# EAGLE design esp-energy-monitor-v2 (EAGLE 9.6.2)
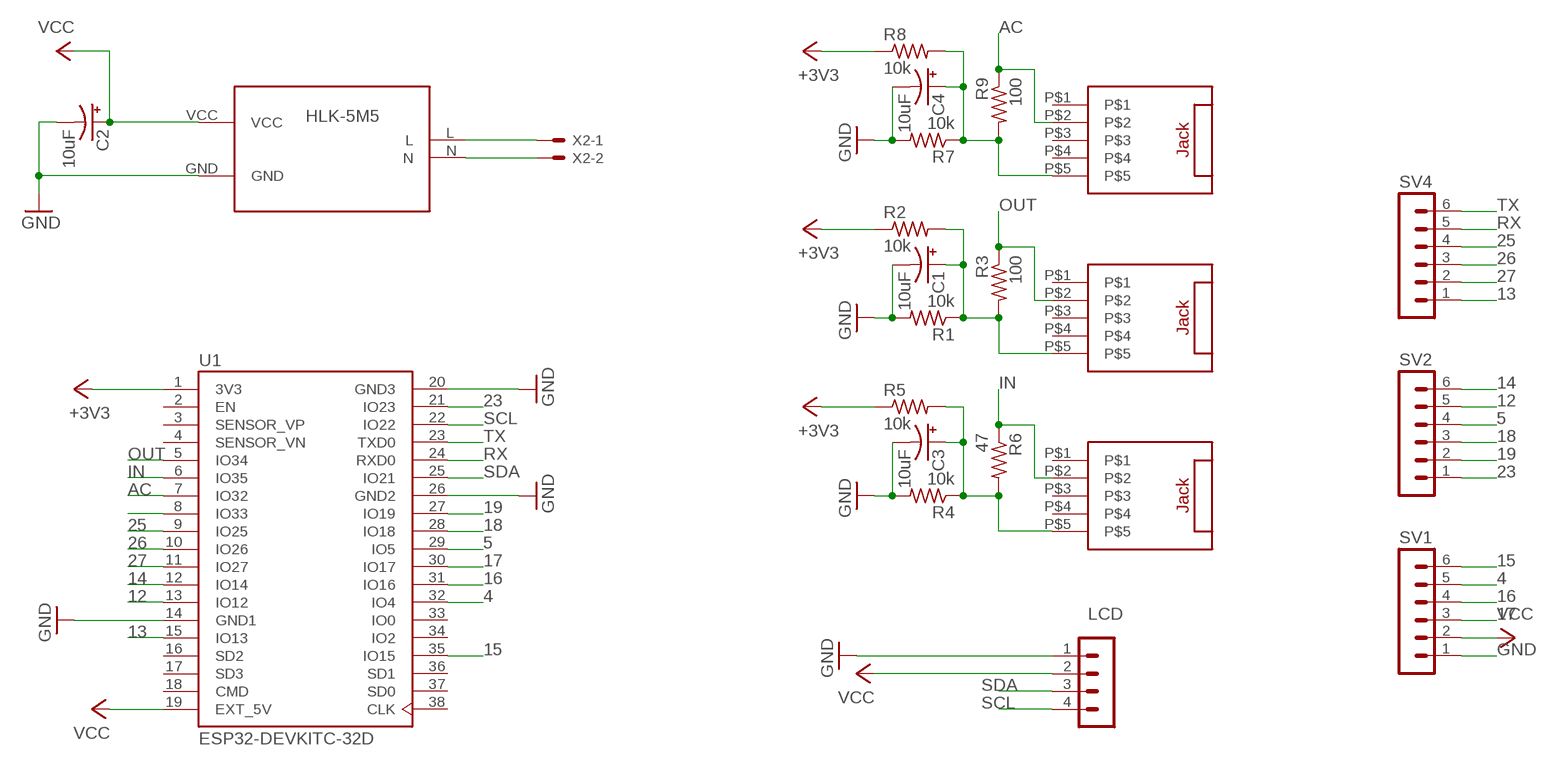
[diagram p0: schematic, sheet 1]

## Parts
ACJACK  JACK_5PINS  [JACK_5PINS]
C1  10uF  CPOL-USB45181A  [B45181A]
C2  10uF  CPOL-USB45181A  [B45181A]
C3  10uF  CPOL-USB45181A  [B45181A]
C4  10uF  CPOL-USB45181A  [B45181A]
HLK-5M5  HLK-5M05  [CONV_HLK-5M05]
INJACK  JACK_5PINS  [JACK_5PINS]
OUTJACK  JACK_5PINS  [JACK_5PINS]
R1  10k  R-US_0204/7  [0204/7]
R2  10k  R-US_0204/7  [0204/7]
R3  100  R-US_0204/7  [0204/7]
R4  10k  R-US_0204/7  [0204/7]
R5  10k  R-US_0204/7  [0204/7]
R6  47  R-US_0204/7  [0204/7]
R7  10k  R-US_0204/7  [0204/7]
R8  10k  R-US_0204/7  [0204/7]
R9  100  R-US_0204/7  [0204/7]
SV1  MA06-1  [MA06-1]
SV2  MA06-1  [MA06-1]
SV3  MA04-1  [MA04-1]
SV4  MA06-1  [MA06-1]
U1  ESP32-DEVKITC-32D  [MODULE_ESP32-DEVKITC-32D]
X2  JST-XH-02-PIN-LONG-PAD  [JST-XH-02-PACKAGE-LONG-PAD]

## Nets
4: SV1.5 U1.32(IO4)
5: SV2.4 U1.29(IO5)
12: SV2.5 U1.13(IO12)
13: SV4.1 U1.15(IO13)
14: SV2.6 U1.12(IO14)
15: SV1.6 U1.35(IO15)
16: SV1.4 U1.31(IO16)
17: SV1.3 U1.30(IO17)
18: SV2.3 U1.28(IO18)
19: SV2.2 U1.27(IO19)
23: SV2.1 U1.21(IO23)
25: SV4.4 U1.9(IO25)
26: SV4.3 U1.10(IO26)
27: SV4.2 U1.11(IO27)
+3V3: R2.1 R5.1 R8.1 U1.1(3V3)
AC: ACJACK.P$2 R9.1 U1.7(IO32)
GND: C1.- C2.- C3.- C4.- HLK-5M5.GND R1.2 R4.2 R7.2 SV1.1 SV3.1 U1.14(GND1) U1.20(GND3) U1.26(GND2)
IN: INJACK.P$2 R6.1 U1.6(IO35)
N$1: HLK-5M5.N X2.2
N$2: HLK-5M5.L X2.1
N$3: C1.+ OUTJACK.P$5 R1.1 R2.2 R3.2
N$4: ACJACK.P$5 C4.+ R7.1 R8.2 R9.2
N$5: C3.+ INJACK.P$5 R4.1 R5.2 R6.2
N$23: U1.8(IO33)
OUT: OUTJACK.P$2 R3.1 U1.5(IO34)
RX: SV4.5 U1.24(RXD0)
SCL: SV3.4 U1.22(IO22)
SDA: SV3.3 U1.25(IO21)
TX: SV4.6 U1.23(TXD0)
VCC: C2.+ HLK-5M5.VCC SV1.2 SV3.2 U1.19(EXT_5V)
Unconnected: ACJACK.P$1 ACJACK.P$3 ACJACK.P$4 INJACK.P$1 INJACK.P$3 INJACK.P$4 OUTJACK.P$1 OUTJACK.P$3 OUTJACK.P$4 U1.2(EN) U1.3(SENSOR_VP) U1.4(SENSOR_VN) U1.16(SD2) U1.17(SD3) U1.18(CMD) U1.33(IO0) U1.34(IO2) U1.36(SD1) U1.37(SD0) U1.38(CLK)

## Notes on the sheet
- HLK-5M5
- LCD

## Library data of the parts
ACJACK INJACK OUTJACK = jack:JACK_5PINS
C1-C4 = adafruit:CPOL-US: POLARIZED CAPACITOR, American symbol
HLK-5M5 = HLK-PM03:HLK-5M05
R1-R9 = adafruit:R-US_: RESISTOR, American symbol
SV1 SV2 SV4 = con-lstb:MA06-1: PIN HEADER; OC_FARNELL: unknown; OC_NEWARK: unknown
SV3 = con-lstb:MA04-1: PIN HEADER; OC_FARNELL: unknown; OC_NEWARK: unknown
U1 = ESP32-DEVKITC-32D:ESP32-DEVKITC-32D: Eval Board For Esp-Wroom-32 Check availability <https://pricing.snapeda.com/parts/ESP32-DEVKITC-32D/Espressif%20Systems/view-part?ref=eda>; AVAILABILITY: In Stock; DESCRIPTION: WiFi Development Tools (802.11) ESP32 General Development Kit, ESP32-WROOM-32D on the board; MF: Espressif Systems; MP: ESP32-DEVKITC-32D; PACKAGE: None; PRICE: None; PURCHASE-URL: https://pricing.snapeda.com/search/part/ESP32-DEVKITC-32D/?ref=eda
X2 = jstConnector-2.5:JST-XH-02-PIN: JST XH Connector 2 Pin Wire to board connector. Pitch: 2,54 mm, (0.100") Number of pins: 2 Created by Rembrandt Electronics www.rembrandtelectronics.com

## Net classes
0 default: width 0.406 mm

## Board
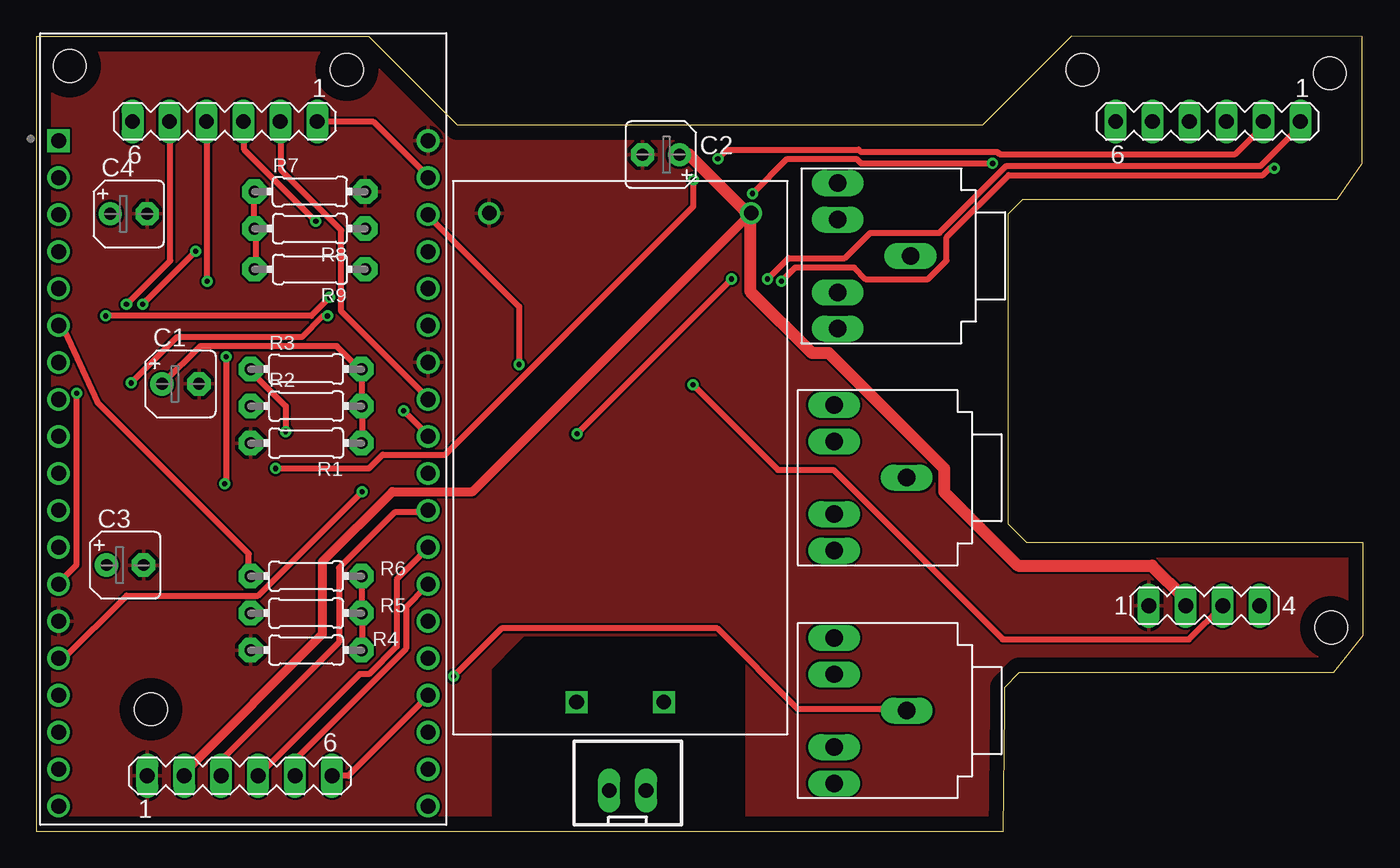
[diagram p1: board, top side]
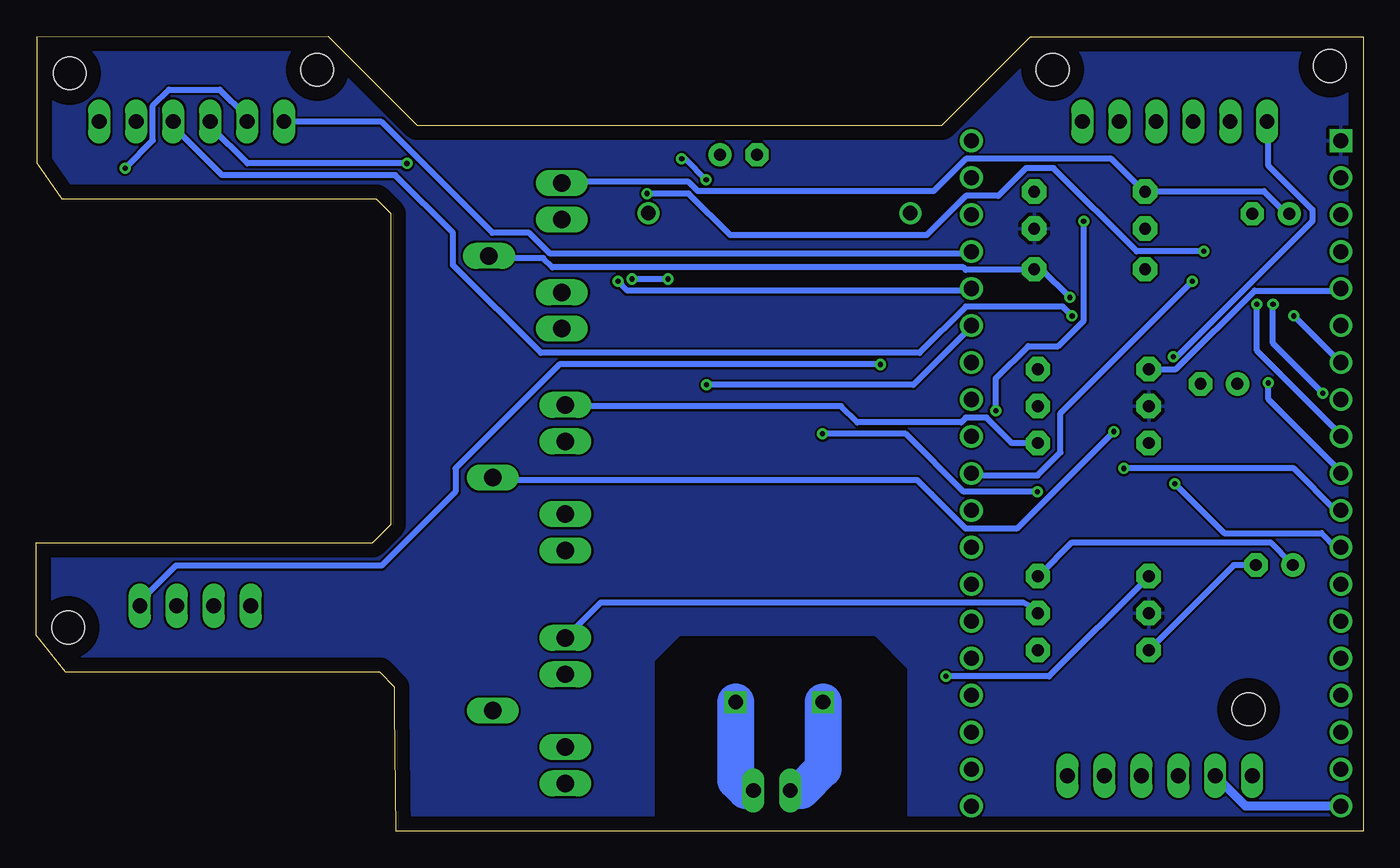
[diagram p2: board, bottom side, seen from below]

Size 91.19 x 54.61 mm. Coordinates in mm from the lower left corner, seen from the top.
Outline: 0,0 66.47,0 66.55,8.38 66.55,9.91 67.56,10.92 89.15,10.92 91.19,13.46 91.19,19.81 68.07,19.81 66.8,21.08 66.8,42.42 67.82,43.43 89.41,43.43 91.11,45.9 91.11,54.6 71.12,54.61 65.02,48.51 28.96,48.51 22.87,54.6 0,54.6 0,0
Copper layers (1*16): Top 0.035mm / dielectric 1.5mm / Bottom 0.035mm
Design rules "default": minimum track width 6mil, minimum drill 0.35mm, track to track 6mil, track to pad 6mil, pad to pad 6mil, via to via 6mil, smd to smd 6mil, copper to edge 40mil, drill to drill 6mil, minimum pad ring 10mil, minimum via ring 8mil, stop-mask expansion 4mil, vias tented up to drill 0mil, thermal gap 10mil
Holes 2.25 mm at 88.9,52.07 89,14 71.88,52.32 21.34,52.32 2.29,52.58 7.87,8.38

### Footprints (pad centres in the part's own frame; a part is rotated, then mirrored left to right if it is on the bottom)
JACK_5PINS = drill 1.2 long: P$1 2.5,1; P$2 7.5,6; P$3 2.5,3.5; P$4 2.5,8.5; P$5 2.5,11
B45181A = drill 0.813 pad 1.6: + -1.27,0 | drill 0.813 pad 1.6 octagon: - 1.27,0
CONV_HLK-5M05 = drill 1: GND 15.8,8.5; VCC 15.8,-9.5 | drill 1 square: L -17.8,2.5; N -17.8,-3.5
0204/7 = drill 0.813 pad 1.676 octagon: 1 -3.81,0; 2 3.81,0
MA06-1 = drill 1.016 long: 1 -6.35,0; 2 -3.81,0; 3 -1.27,0; 4 1.27,0; 5 3.81,0; 6 6.35,0
MA04-1 = drill 1.016 long: 1 -3.81,0; 2 -1.27,0; 3 1.27,0; 4 3.81,0
MODULE_ESP32-DEVKITC-32D = drill 1.04 square: 1 -12.7,19.76 | drill 1.04: 2 -12.7,17.22; 3 -12.7,14.68; 4 -12.7,12.14; 5 -12.7,9.6; 6 -12.7,7.06; 7 -12.7,4.52; 8 -12.7,1.98; 9 -12.7,-0.56; 10 -12.7,-3.1; 11 -12.7,-5.64; 12 -12.7,-8.18; 13 -12.7,-10.72; 14 -12.7,-13.26; 15 -12.7,-15.8; 16 -12.7,-18.34; 17 -12.7,-20.88; 18 -12.7,-23.42; 19 -12.7,-25.96; 20 12.7,19.76; 21 12.7,17.22; 22 12.7,14.68; 23 12.7,12.14; 24 12.7,9.6; 25 12.7,7.06; 26 12.7,4.52; 27 12.7,1.98; 28 12.7,-0.56; 29 12.7,-3.1; 30 12.7,-5.64; 31 12.7,-8.18; 32 12.7,-10.72; 33 12.7,-13.26; 34 12.7,-15.8; 35 12.7,-18.34; 36 12.7,-20.88; 37 12.7,-23.42; 38 12.7,-25.96
JST-XH-02-PACKAGE-LONG-PAD = drill 1.016 long: 1 -1.27,0; 2 1.27,0

### Placement (x,y rotation side)
ACJACK  52.58,33.53 0 top
C1  9.91,30.73 0 top
C2  42.93,46.48 180 top
C3  6.1,18.29 0 top
C4  6.35,42.42 0 top
HLK-5M5  39.62,26.67 90 top
INJACK  52.32,2.29 0 top
OUTJACK  52.32,18.29 0 top
R1  18.54,26.67 180 top
R2  18.54,29.21 0 top
R3  18.54,31.75 0 top
R4  18.54,12.45 180 top
R5  18.54,14.99 0 top
R6  18.54,17.53 0 top
R7  18.8,43.94 0 top
R8  18.8,41.4 180 top
R9  18.8,38.61 180 top
SV1  13.97,3.81 0 top
SV2  12.95,48.77 180 top
SV3  80.26,15.49 0 top
SV4  80.52,48.77 180 top
U1  14.22,27.69 0 top
X2  40.64,2.79 0 top

### Tracks (layer width: path | path; a pad name or v marks a point on that pad's centre or on a via)
4
  Top 0.406: SV1.5 17.78,4.92 25.4,12.54 25.4,15.4 26.83,16.83 U1.32
5  (via drill 0.35)
  Top 0.406: v11.75,37.78 11.75,48.74 SV2.4
  Bottom 0.406: v11.75,37.78 20.8,28.73 20.8,26.04 22.38,24.45 26.83,24.45 U1.29
12  (via drill 0.35)
  Top 0.406: v6.19,36.2 9.21,39.21 9.21,48.74 SV2.5 | v2.76,30.1 2.76,18.32 1.43,16.99 U1.13
  Bottom 0.406: v6.19,36.2 6.19,33.53 v2.76,30.1
13  (via drill 0.35)
  Top 0.406: 1.62,11.88 U1.15 1.75,11.75 6.19,16.19 15.24,16.19 v22.38,23.34 | v50.26,37.94 51.69,39.37 55.56,39.37 57.31,41.12 62.07,41.12 66.67,45.72 84.14,45.72 86.84,48.42 86.84,48.74 SV4.1 | v37.15,27.3 v47.78,37.94
  Bottom 0.406: v47.78,37.94 v50.26,37.94 | v37.15,27.3 31.43,27.3 27.46,23.34 v22.38,23.34
14  (via drill 0.35)
  Top 0.406: v13.04,32.6 13.04,23.97 v12.95,23.88
  Bottom 0.406: SV2.6 6.51,48.74 6.51,45.72 3.49,42.7 3.49,41.91 12.8,32.6 v13.04,32.6 | U1.12 1.59,19.53 1.91,19.53 2.86,20.48 9.56,20.48 v12.95,23.88
15
  Top 0.406: SV1.6 21.43,3.81 26.83,9.21 U1.35
16
  Top 0.406: SV1.4 22.23,10.79 22.86,10.79 24.77,12.7 24.77,17.3 26.83,19.37 U1.31
17
  Top 0.406: SV1.3 12.7,4.89 20.8,12.99 20.8,18.1 24.61,21.91 26.83,21.91 U1.30
18  (via drill 0.35)
  Top 0.406: v19.21,41.91 14.29,46.83 14.29,48.74 SV2.3 | v25.24,28.89 26.99,27.15 U1.28
  Bottom 0.406: v19.21,41.91 19.21,35.08 20.95,33.34 23.02,33.34 25.24,31.11 v25.24,28.89
19
  Top 0.406: SV2.2 16.83,48.74 16.83,45.4 20.95,41.27 20.95,35.72 26.99,29.69 U1.27
23
  Top 0.406: SV2.1 19.37,48.74 23.18,48.74 26.99,44.93 U1.21
25  (via drill 0.35)
  Top 0.406: v65.72,45.88 56.67,45.88 56.36,46.2 51.59,46.2 v49.21,43.81 | v7.3,36.2 v10.95,39.85
  Bottom 0.406: v65.72,45.88 76.68,45.88 79.22,48.42 79.22,48.74 SV4.4 | v49.21,43.81 46.35,43.81 43.5,40.96 30,40.96 27.3,43.66 25.08,43.66 23.18,45.56 21.27,45.56 15.56,39.85 v10.95,39.85 | v7.3,36.2 7.3,33.02 1.43,27.15 U1.9
26  (via drill 0.35)
  Top 0.406: v20,35.4 19.68,35.4 18.26,33.97 9.68,33.97 v6.51,30.8
  Bottom 0.406: v20,35.4 20.64,36.04 27.3,36.04 30.48,32.86 56.52,32.86 62.55,38.89 62.55,41.12 66.52,45.09 78.42,45.09 81.76,48.42 81.76,48.74 SV4.3 | v6.51,30.8 6.51,29.69 1.43,24.61 U1.10
27  (via drill 0.35)
  Top 0.406: v46.83,46.2 47.47,46.83 56.52,46.83 56.67,46.67 66.04,46.67 66.2,46.51 82.39,46.51 84.3,48.42 84.3,48.74 SV4.2 | v45.15,44.77 45.15,42.93 28.1,25.88 23.81,25.88 22.86,24.92 v16.45,24.92
  Bottom 0.406: v46.83,46.2 46.58,46.2 v45.15,44.77 | v16.45,24.92 4.76,24.92 1.91,22.07 1.59,22.07 U1.11
+3V3
  pour Bottom: 28.96,-4.06 31.24,-1.78 31.24,-1.52 31.24,11.18 33.53,13.46 46.99,13.46 48.77,11.68 48.77,-1.52 49.53,-2.29 93.47,-2.29 93.47,57.66 -1.27,57.66 -2.79,56.13 -2.79,-3.3 -2.54,-3.56 -2.03,-4.06
AC  (via drill 0.35)
  Top 0.406: v4.76,35.4 18.89,35.4 v20.16,36.67
  Bottom 0.406: v4.76,35.4 1.59,32.23 U1.7 | v20.16,36.67 22.07,38.58 22.54,38.58 R9.1 22.7,38.58 27.3,38.58 27.46,38.73 55.72,38.73 56.36,39.37 60.01,39.37 ACJACK.P$2
GND
  Bottom 0.406: C3.- 8.89,18.29 R4.2
  pour Top: 31.24,-1.52 31.24,11.18 33.02,12.95 33.53,13.46 46.48,13.46 46.99,13.46 48.77,11.68 48.77,-1.78 49.02,-2.03 92.71,-2.03 93.73,-1.02 94.74,0 94.74,57.91 -3.3,57.91 -3.56,57.66 -3.56,-3.3 -3.05,-3.81 28.96,-3.81
IN  (via drill 0.35)
  Top 0.406: U1.6 1.99,34.28 4.21,29.45 14.61,19.05 14.61,17.62 R6.1 | v28.67,10.64 31.97,13.94 46.8,13.94 52.32,8.41 59.69,8.41 INJACK.P$2
  Bottom 0.406: v28.67,10.64 21.59,10.64 14.76,17.46 R6.1
N$1
  Bottom 0.406: X2.2 42,2.75 42.42,2.79
  Bottom 2.54: HLK-5M5.N 43.12,3.5 42.42,2.79
N$2
  Bottom 0.406: X2.1 39.38,2.75 38.61,2.79
  Bottom 2.54: HLK-5M5.L 37.12,4.28 38.61,2.79
N$3
  Top 0.406: C1.+ 8.73,30.8 11.27,33.34 20.64,33.34 22.23,31.75 R3.2 22.38,31.59 22.38,29.37 R2.2 22.38,29.21 22.38,26.67 R1.1
  Bottom 0.406: R1.1 24.13,26.67 25.88,28.42 27.3,28.42 27.62,28.1 34.77,28.1 35.88,29.21 54.77,29.21 OUTJACK.P$5
N$4
  Top 0.406: R9.2 15.08,38.73 15.08,41.27 R8.2 14.92,41.59 14.92,43.81 R7.1
  Bottom 0.406: 4.84,42.22 C4.+ 5.24,42.39 6.83,43.97 14.92,43.97 R7.1 15.08,43.97 17.3,46.2 27.3,46.2 29.53,43.97 45.72,43.97 46.35,44.61 54.93,44.61 ACJACK.P$5
N$5
  Top 0.406: R4.1 22.38,12.54 22.38,14.92 R5.2 22.38,15.08 22.38,17.46 R6.2
  Bottom 0.406: C3.+ 4.92,18.41 6.35,19.84 20,19.84 22.23,17.62 R6.2 | INJACK.P$5 52.39,15.72 23.38,15.72 22.78,15.41 R5.2
OUT  (via drill 0.35)
  Top 0.406: v17.14,27.46 17.14,29.21 14.61,31.75 R3.1
  Bottom 0.406: R3.1 12.86,31.75 7.46,37.15 1.59,37.15 U1.5 | v17.14,27.46 23.81,20.8 27.3,20.8 29.67,23.16 30.64,24.13 59.69,24.13 OUTJACK.P$2
RX  (via drill 0.35)
  Top 0.406: v85.09,45.56 84.77,45.56 84.3,45.09 66.83,45.09 62.55,40.8 62.55,39.21 61.28,37.94 56.99,37.94 56.2,38.73 52.16,38.73 v51.21,37.78
  Bottom 0.406: v85.09,45.56 83.19,47.47 83.19,49.85 82.07,50.96 78.58,50.96 76.83,49.21 76.83,48.9 SV4.5 | v51.21,37.78 50.58,37.15 26.99,37.15 U1.24
SCL  (via drill 0.35)
  Top 0.406: v33.18,32.07 33.18,36.04 26.99,42.23 U1.22
  Bottom 0.406: v33.18,32.07 55.24,32.07 62.39,24.92 62.39,23.34 67.47,18.26 81.6,18.26 83.98,15.88 83.98,15.56 SV3.4
SDA  (via drill 0.35)
  Top 0.406: SV3.3 79.22,13.18 66.42,13.18 54.77,24.83 50.96,24.83 v45.12,30.67
  Bottom 0.406: v45.12,30.67 30.92,30.67 26.99,34.61 U1.25
TX
  Bottom 0.406: SV4.6 74.14,48.74 67.47,48.74 59.85,41.12 57.31,41.12 55.88,39.69 26.99,39.69 U1.23
VCC
  Top 0.406: 78.9,16.03 78.9,15.56 SV3.2 | 49.05,42.07 HLK-5M5.VCC
  Top 0.61: 10.16,4.03 19.65,13.53 19.65,18.51 24.48,23.34 29.99,23.34 HLK-5M5.VCC
  Top 0.813: C2.+ 44.86,46.48 48.87,42.47 HLK-5M5.VCC | 78.9,16.03 76.68,18.26 67.47,18.26 62.39,23.34 62.39,24.92 54.45,32.86 53.31,32.86 49.05,37.12 49.05,42.07 | SV1.2 10.16,4.03
  Bottom 0.61: U1.19 8.08,1.73 SV1.2

### Text on the board
tTest: 14 | 12 | 5 | 18 | 19 | TX | RX | 25 | 26 | 27 | 3 | 23 | AC | ESP32 | HLK-5M05 | OUT | gnd | vcc | sda | scl | IN | gnd | vcc | 17 | 16 | 4 | JLCJLCJLCJLC | 15 | 220VAC
bTest: energy monitor v2 | Il garage del Bicchio